# Altium schematic sheet CommBoard.SchDoc
size A4
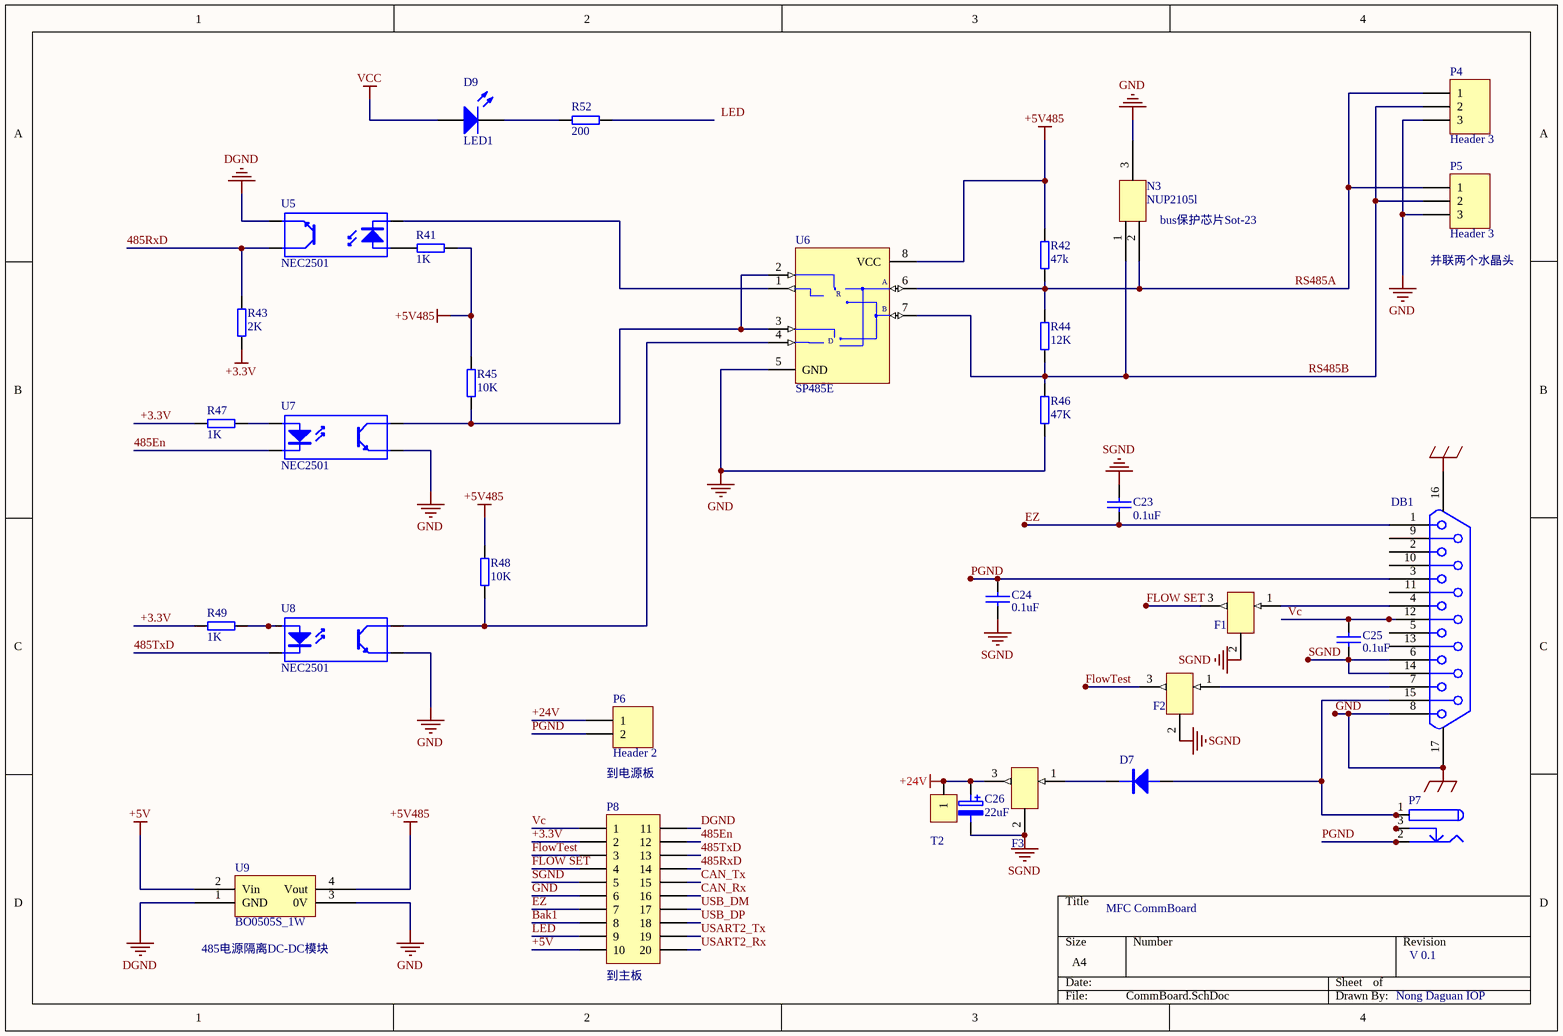
[diagram p0: CommBoard.SchDoc]

## Parts
C23  0.1uF  [R.4]
C24  0.1uF  [R.4]
C25  0.1uF  [R.4]
C26  22uF  [CA-22U]
D7  2CK73C  [DIODE]  (value not drawn)
D9  LED1  [LED-1]
DB1  DB15  [DB15RA/M]  (value not drawn)
F1  TL-221M 100V  [FILTER]  (value not drawn)
F2  TL-221M 100V  [FILTER]  (value not drawn)
F3  TL-221M 100V  [FILTER]  (value not drawn)
N3  NUP2105l
P4  Header 3  [HDR1X3]
P5  Header 3  [HDR1X3]
P6  Header 2  [HDR1X2]
P7  (no value)  [KLD-0202]
P8  (no value)  [HDR2X10_CEN]
R41  1K  [R.4]
R42  47k  [R.4]
R43  2K  [R.4]
R44  12K  [R.4]
R45  10K  [R.4]
R46  47K  [R.4]
R47  1K  [R.4]
R48  10K  [R.4]
R49  1K  [R.4]
R52  200  [R.4]
T2  CON1  [PAD - RECT]  (value not drawn)
U5  NEC2501  [DIP-4]
U6  SP485E  [SOT23-8]
U7  NEC2501  [DIP-4]
U8  NEC2501  [DIP-4]
U9  BO0505S_1W

## Nets
+3.3V: P8.2 R43.1 R47.1 R49.1
+5V: P8.10 U9.2(Vin)
+5V485: R41.2 R42.2 R45.2 R48.2 U6.8(VCC) U9.4(Vout)
+24V: C26.1 F3.3(OUT) P6.1 T2.1
DGND: P8.11 U5.3(E) U9.1(GND)
GND: DB1.8 DB1.16(Pad) DB1.17(Pad) N3.3 P4.3 P5.3 P8.6 R46.1 U6.5(GND) U7.3(E) U8.3(E) U9.3(0V)
SGND: C23.2 C24.1 C25.1 C26.2 DB1.6 DB1.14 F1.2(GND) F2.2(GND) F3.2(GND) P8.5
VCC: D9.1(A)
485En: P8.12 U7.2(K)
485RxD: P8.14 R43.2 U5.4(C)
485TxD: P8.13 U8.2(K)
Bak1: P8.8
CAN_Rx: P8.16
CAN_Tx: P8.15
EZ: C23.1 DB1.1 P8.7
FLOW SET: F1.3(OUT) P8.4
FlowTest: F2.3(OUT) P8.3
LED: P8.9
PGND: C24.2 DB1.3 P6.2 P7.2 P7.2A P7.2B
RS485A: N3.2 P4.1 P5.1 R42.1 R44.2 U6.6(A)
RS485B: N3.1 P4.2 P5.2 R44.1 R46.2 U6.7(B)
USART2_Rx: P8.20
USART2_Tx: P8.19
USB_DM: P8.17
USB_DP: P8.18
Vc: C25.2 DB1.12 P8.1
NetD7_A: D7.A DB1.15 P7.1 P7.1A P7.1B
NetD7_K: D7.K F3.1(IN)
NetD9_2: D9.2(K) R52.1
NetDB1_4: DB1.4 F1.1(IN)
NetDB1_7: DB1.7 F2.1(IN)
NetP7_3: P7.3 P7.3A P7.3B
NetR41_1: R41.1 U5.1(A)
NetR45_1: R45.1 U6.2(~{RE}) U6.3(DE) U7.4(C)
NetR47_2: R47.2 U7.1(A)
NetR48_1: R48.1 U6.4(DI) U8.4(C)
NetR49_2: R49.2 U8.1(A)
NetU5_2: U5.2(K) U6.1(RO)

Not connected (* = marked no-connect by the designer): DB1 2 5 9 10 11 13; R52 2

## Notes on the sheet
- (near N3) bus保护芯片Sot-23
- (near P5) 并联两个水晶头
- 到电源板
- MFC CommBoard
- (near U9) 485电源隔离DC-DC模块
- (near P8) 到主板
- V 0.1
- Nong Daguan IOP
- Labels drawn without touching a wire or pin: LED
- (in symbol D-221-0010) R; D

## Library data of the parts
C23-C25 = CAP
C26 = ELECTRO2
D7 = DIODE
D9 = LED1: Typical RED GaAs LED; Published: 8-Jun-2000; LatestRevisionDate: 08-Jul-2005; LatestRevisionNote: Mech Layer 1 removed.; PackageReference: LED-1; Publisher: Altium Limited; PackageDescription: LED; 2 Leads
F1-F3 = FILTER
P4 P5 = Header 3: Header, 3-Pin; LatestRevisionDate: 17-Jul-2002; LatestRevisionNote: Re-released for DXP Platform.; Publisher: Altium Limited
P6 = Header 2: Header, 2-Pin; LatestRevisionDate: 17-Jul-2002; LatestRevisionNote: Re-released for DXP Platform.; Publisher: Altium Limited
P7 = PWR2.5: Low Voltage Power Supply Connector; Publisher: Altium Limited; Published: 17-Dec-2003; DatasheetDocument: 09-May-2002; ComponentLink1Description: Manufacturer Link; ComponentLink1URL: http://domino.kycon.com/internet/Products.html
P8 = Header 10X2A: Header, 10-Pin, Dual row; LatestRevisionDate: 17-Jul-2002; LatestRevisionNote: Re-released for DXP Platform.; Publisher: Altium Limited
R41-R49 R52 = RES_1
U5 U7 U8 = Optoisolator1: 4-Pin Phototransistor Optocoupler; Published: 24-Mar-1999; LatestRevisionDate: 04-Mar-2005; LatestRevisionNote: Sch pins 3 & 4 Swapped.; DatasheetVersion: Nov-2003; PackageReference: DIP-4; Publisher: Altium Limited
U6 = D-221-0010: MAX3362 3.3V, High-Speed, RS-485/RS-422 Transceiver in  SOT Package; Comm Standard: None; Mounting Technology: Surface Mount; Status: Unreleased; Category: IC-Communication